# Altium schematic sheet Isolation.SchDoc
size A4; SheetNumber: 10; SheetTotal: 11
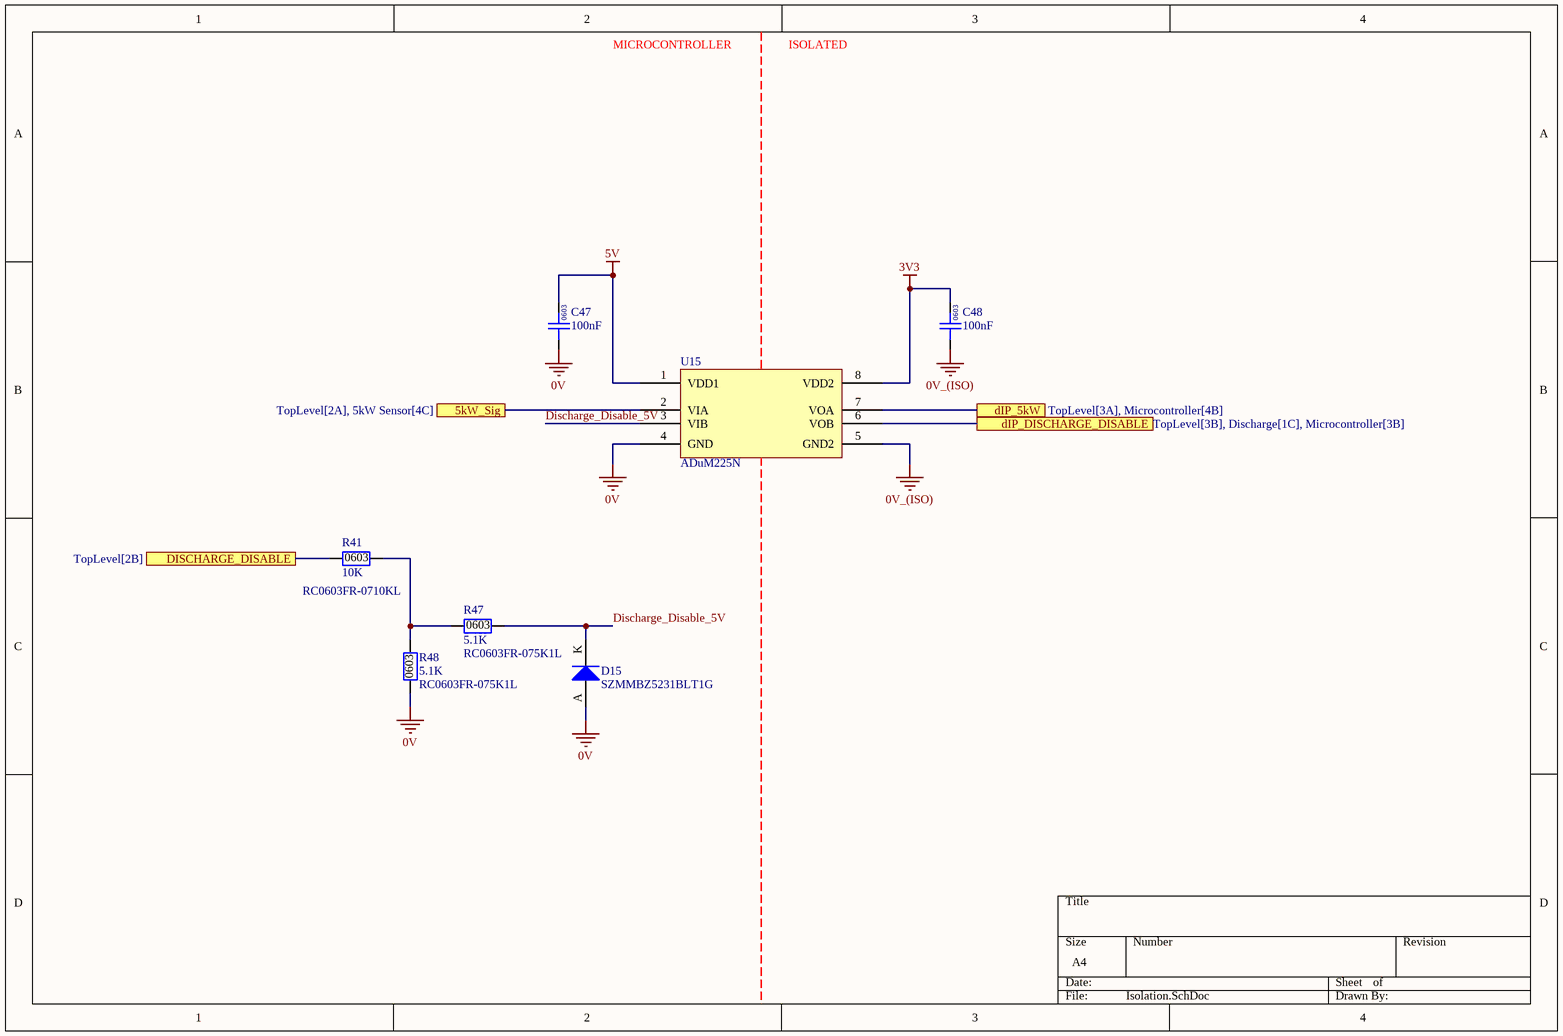
[diagram p0: Isolation.SchDoc]

## Parts
C47  100nF  [0603]
C48  100nF  [0603]
D15  SZMMBZ5231BLT1G  [SOT23-3]
R41  RC0603FR-0710KL  value 10K  [RESC0603]
R47  RC0603FR-075K1L  value 5.1K  [RESC0603]
R48  RC0603FR-075K1L  value 5.1K  [RESC0603]
U15  ADuM225N  [AD-SOIC-8W]

## Ports
5kW_Sig (see TopLevel[2A], 5kW Sensor[4C]), dIP_5kW (see TopLevel[3A], Microcontroller[4B]), dIP_DISCHARGE_DISABLE (see TopLevel[3B], Discharge[1C], Microcontroller[3B]), DISCHARGE_DISABLE (see TopLevel[2B])

## Nets
0V: C47.1 D15.A R48.1 U15.4(GND)
0V_(ISO): C48.1 U15.5(GND2)
3V3: C48.2 U15.8(VDD2)
5V: C47.2 U15.1(VDD1)
5kW_Sig: U15.2(VIA) ; port 5kW_Sig
dIP_5kW: U15.7(VOA) ; port dIP_5kW
dIP_DISCHARGE_DISABLE: U15.6(VOB) ; port dIP_DISCHARGE_DISABLE
DISCHARGE_DISABLE: R41.1 ; port DISCHARGE_DISABLE
Discharge_Disable_5V: D15.K R47.2 U15.3(VIB)
NetR41_2: R41.2 R47.1 R48.2

## Notes on the sheet
- MICROCONTROLLER
- ISOLATED
- (in symbol GCM188L81H104KA57D) 0603

## Library data of the parts
C47 C48 = GCM188L81H104KA57D: Manufacturer: muRata; Rated Voltage: 50V; Tolerance: ±10%; Material: MLCC; Temperature Rating: X8L; Part Number: GCM188L81H104KA57D; Value: 100nF; Digikey Part Number: 490-6049-1-ND
D15 = CMP-107-000002-2: Zener Diode, 5.1V V(Z), 5.1%, 0.225W, Silicon, Unidirectional, TO-236AB; Part Number: BAS21; Package Body Material: Plastic; Dynamic Impedance-Max: 17R; Number of Elements: 1; Max Power Dissipation: 225mW; Test Current: 20mA; Reference Standard: AEC-Q101; Digikey Link: #https://www.digikey.com.au/en/products/detail/smc-diode-solutions/BAS21/6022500#; JEDEC-95 Code: TO-236AB; Diode Type: ZENER; Package Shape: Rectangular; Reach SVHC Compliant: Yes; JESD-30 Code: R-PDSO-G3; Package Style: SMALL OUTLINEMeter; Technology: ZENER; Surface Mount: Yes; RoHS Compliant: Yes; Reference Voltage-Nom: 5.1V; JESD-609 Code: e3; Moisture Sensitivity Level: 1; Terminal Finish: Tin; Diode Element Material: SILICON; Voltage Tol-Max: 5.1%; Pins: 3; Min Operating Temperature: -65°C; Polarity: Unidirectional; Terminal Position: DUAL; Terminal Form: Gull Wing; Max Operating Temperature: 150°C
R41 = CMP-RES-0102-2: RES SMD 10K OHM JUMPER 1/10W 0603; Tolerance: 1%; Power Rating: 100mW; Voltage Rating: 50V; Min Operating Temperature: -55°C; Case/Package: 0603; Max Operating Temperature: 155°C
R47 R48 = CMP-RES-0095-2: RES SMD 5.1K OHM JUMPER 1/10W 0603; Tolerance: 1%; Power Rating: 100mW; Voltage Rating: 50V; Case/Package: 0603; Max Operating Temperature: 155°C; Min Operating Temperature: -55°C
U15 = ADuM225N: DIGITAL ISOLATOR, DUAL CHANNEL; Manufacturer: Analogue Devices; Part Number: ADuM225N